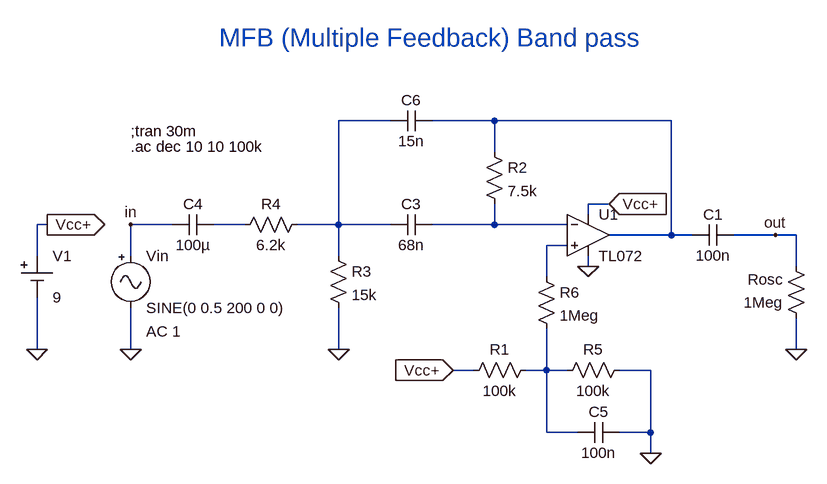
[diagram p0: schematic multiple-feedback-band-pass.asc]
multiple-feedback-band-pass.asc, the LTspice schematic file:
Version 4
SHEET 1 1284 824
WIRE -384 -32 -464 -32
WIRE -224 -32 -320 -32
WIRE 48 -32 -224 -32
WIRE -224 16 -224 -32
WIRE -48 96 -80 96
WIRE -80 112 -80 96
WIRE -912 128 -928 128
WIRE -720 128 -784 128
WIRE -608 128 -656 128
WIRE -464 128 -464 -32
WIRE -464 128 -528 128
WIRE -384 128 -464 128
WIRE -224 128 -224 96
WIRE -224 128 -320 128
WIRE -112 128 -224 128
WIRE 48 144 48 -32
WIRE 48 144 -48 144
WIRE 80 144 48 144
WIRE 208 144 144 144
WIRE 240 144 208 144
WIRE -112 160 -144 160
WIRE -928 176 -928 128
WIRE -784 176 -784 128
WIRE -464 176 -464 128
WIRE -80 192 -80 176
WIRE 240 192 240 144
WIRE -144 208 -144 160
WIRE -928 320 -928 240
WIRE -784 320 -784 256
WIRE -464 320 -464 256
WIRE 240 320 240 272
WIRE -256 352 -288 352
WIRE -144 352 -144 288
WIRE -144 352 -176 352
WIRE -112 352 -144 352
WIRE 16 352 -32 352
WIRE -144 448 -144 352
WIRE -96 448 -144 448
WIRE 16 448 16 352
WIRE 16 448 -32 448
WIRE 16 480 16 448
FLAG -928 320 0
FLAG -912 128 Vcc+
IOPIN -912 128 Out
FLAG -784 128 in
FLAG -48 96 Vcc+
IOPIN -48 96 In
FLAG 208 144 out
FLAG -288 352 Vcc+
IOPIN -288 352 In
FLAG -80 192 0
FLAG 240 320 0
FLAG -464 320 0
FLAG -784 320 0
FLAG 16 480 0
SYMBOL TL072 -80 80 R0
SYMATTR InstName U1
SYMBOL signal -784 160 R0
WINDOW 123 24 132 Left 2
WINDOW 39 24 160 Left 2
SYMATTR Value2 AC 1
SYMATTR InstName Vin
SYMATTR Value SINE(0 0.5 200 0 0)
SYMBOL cell -928 176 R0
WINDOW 123 0 0 Left 2
WINDOW 39 0 0 Left 2
SYMATTR InstName V1
SYMATTR Value 9
SYMBOL cap 144 128 R90
WINDOW 0 0 32 VBottom 2
WINDOW 3 32 32 VTop 2
SYMATTR InstName C1
SYMATTR Value 100n
SYMBOL res 256 288 R180
WINDOW 0 36 76 Left 2
WINDOW 3 36 40 Left 2
SYMATTR InstName Rosc
SYMATTR Value 1Meg
SYMBOL res -272 368 R270
WINDOW 0 32 56 VTop 2
WINDOW 3 0 56 VBottom 2
SYMATTR InstName R1
SYMATTR Value 100k
SYMBOL res -128 368 R270
WINDOW 0 32 56 VTop 2
WINDOW 3 0 56 VBottom 2
SYMATTR InstName R5
SYMATTR Value 100k
SYMBOL cap -656 112 R90
WINDOW 0 0 32 VBottom 2
WINDOW 3 32 32 VTop 2
SYMATTR InstName C4
SYMATTR Value 100µ
SYMBOL cap -96 464 R270
WINDOW 0 32 32 VTop 2
WINDOW 3 0 32 VBottom 2
SYMATTR InstName C5
SYMATTR Value 100n
SYMBOL res -160 192 R0
SYMATTR InstName R6
SYMATTR Value 1Meg
SYMBOL res -240 0 R0
SYMATTR InstName R2
SYMATTR Value 7.5k
SYMBOL cap -320 112 R90
WINDOW 0 0 32 VBottom 2
WINDOW 3 32 32 VTop 2
SYMATTR InstName C3
SYMATTR Value 68n
SYMBOL cap -320 -48 R90
WINDOW 0 0 32 VBottom 2
WINDOW 3 32 32 VTop 2
SYMATTR InstName C6
SYMATTR Value 15n
SYMBOL res -480 160 R0
SYMATTR InstName R3
SYMATTR Value 15k
SYMBOL res -512 112 R90
WINDOW 0 0 56 VBottom 2
WINDOW 3 32 56 VTop 2
SYMATTR InstName R4
SYMATTR Value 6.2k
TEXT -784 -16 Left 2 !;tran 30m
TEXT -784 8 Left 2 !.ac dec 10 10 100k
TEXT -648 -160 Left 4 ;MFB (Multiple Feedback) Band pass

The netlist it stands for:
* multiple-feedback-band-pass.asc
* U1: TL072 (symbol TL072 not available, pins judged from their places): In+=N005 In-=N004 V+=Vcc+ V-=0 OUT=N002
Vin in 0 SINE(0 0.5 200 0 0) AC 1
V1 Vcc+ 0 9
C1 out N002 100n
Rosc 0 out 1Meg
R1 Vcc+ N006 100k
R5 N006 0 100k
C4 N003 in 100µ
C5 N006 0 100n
R6 N005 N006 1Meg
R2 N002 N004 7.5k
C3 N004 N001 68n
C6 N002 N001 15n
R3 N001 0 15k
R4 N001 N003 6.2k
;tran 30m
.ac dec 10 10 100k
* MFB (Multiple Feedback) Band pass
.backanno
.end